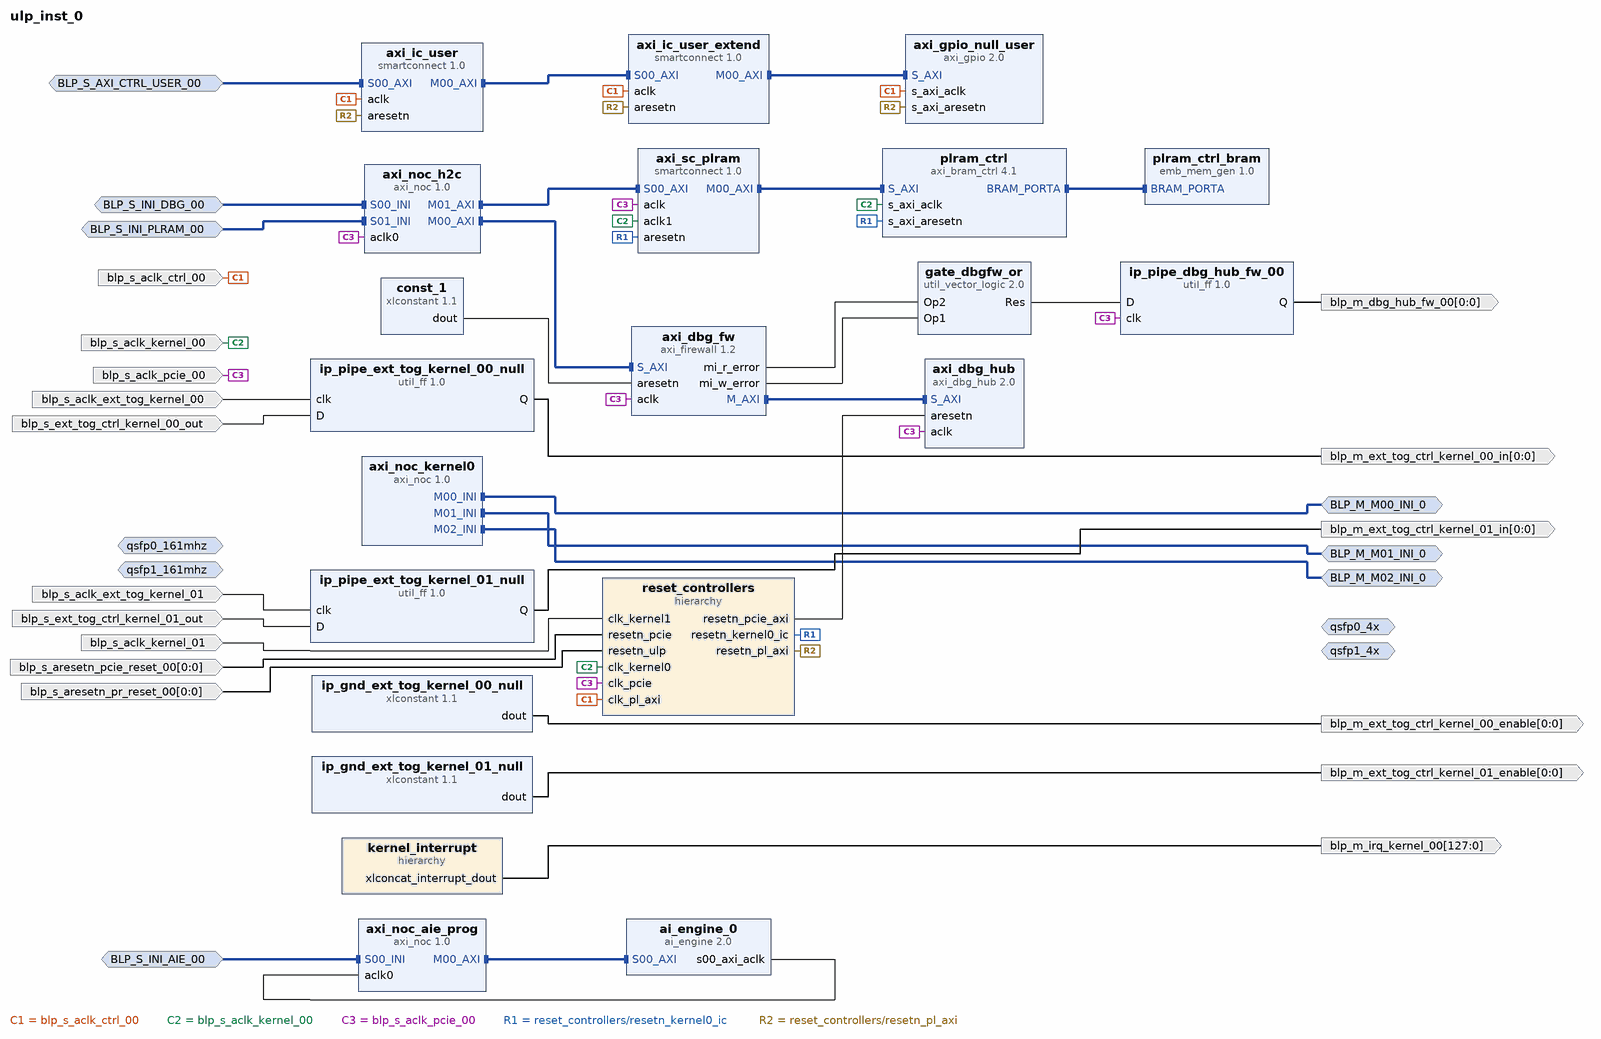
[diagram p0: block diagram of the top level]
# Vivado block design ulp_inst_0, xcvc1902-vsvd1760-2MP-e-S, Vivado 2022.2
create_bd_design ulp_inst_0

create_bd_intf_port -mode Slave -vlnv xilinx.com:interface:aximm_rtl:1.0 BLP_S_AXI_CTRL_USER_00
set_property -dict {CONFIG.master_id 1} [get_bd_intf_ports BLP_S_AXI_CTRL_USER_00]
create_bd_intf_port -mode Slave -vlnv xilinx.com:interface:inimm_rtl:1.0 BLP_S_INI_PLRAM_00
create_bd_intf_port -mode Slave -vlnv xilinx.com:interface:inimm_rtl:1.0 BLP_S_INI_DBG_00
create_bd_intf_port -mode Slave -vlnv xilinx.com:interface:inimm_rtl:1.0 BLP_S_INI_AIE_00
create_bd_intf_port -mode Master -vlnv xilinx.com:interface:inimm_rtl:1.0 BLP_M_M00_INI_0
create_bd_intf_port -mode Master -vlnv xilinx.com:interface:inimm_rtl:1.0 BLP_M_M01_INI_0
create_bd_intf_port -mode Master -vlnv xilinx.com:interface:inimm_rtl:1.0 BLP_M_M02_INI_0
create_bd_intf_port -mode Slave -vlnv xilinx.com:interface:diff_clock_rtl:1.0 qsfp0_161mhz
create_bd_intf_port -mode Master -vlnv xilinx.com:interface:gt_rtl:1.0 qsfp0_4x
create_bd_intf_port -mode Slave -vlnv xilinx.com:interface:diff_clock_rtl:1.0 qsfp1_161mhz
create_bd_intf_port -mode Master -vlnv xilinx.com:interface:gt_rtl:1.0 qsfp1_4x
create_bd_port -dir O -from 127 -to 0 -type intr blp_m_irq_kernel_00
create_bd_port -dir I -type clk blp_s_aclk_ctrl_00
create_bd_port -dir I -type clk blp_s_aclk_kernel_00
create_bd_port -dir I -type clk blp_s_aclk_kernel_01
create_bd_port -dir I -type clk blp_s_aclk_pcie_00
create_bd_port -dir I -from 0 -to 0 -type rst blp_s_aresetn_pcie_reset_00
create_bd_port -dir I -from 0 -to 0 -type rst blp_s_aresetn_pr_reset_00
create_bd_port -dir I -type clk blp_s_aclk_ext_tog_kernel_00
create_bd_port -dir I -type clk blp_s_aclk_ext_tog_kernel_01
create_bd_port -dir I blp_s_ext_tog_ctrl_kernel_00_out
create_bd_port -dir I blp_s_ext_tog_ctrl_kernel_01_out
create_bd_port -dir O -from 0 -to 0 blp_m_ext_tog_ctrl_kernel_00_in
create_bd_port -dir O -from 0 -to 0 blp_m_ext_tog_ctrl_kernel_01_in
create_bd_port -dir O -from 0 -to 0 blp_m_ext_tog_ctrl_kernel_00_enable
create_bd_port -dir O -from 0 -to 0 blp_m_ext_tog_ctrl_kernel_01_enable
create_bd_port -dir O -from 0 -to 0 -type intr blp_m_dbg_hub_fw_00

create_bd_cell -type ip -vlnv xilinx.com:ip:util_ff:1.0 ip_pipe_dbg_hub_fw_00
set_property -dict {CONFIG.C_R_INVERTED 0} [get_bd_cells ip_pipe_dbg_hub_fw_00]
create_bd_cell -type ip -vlnv xilinx.com:ip:util_ff:1.0 ip_pipe_ext_tog_kernel_00_null
set_property -dict {CONFIG.C_R_INVERTED 0} [get_bd_cells ip_pipe_ext_tog_kernel_00_null]
create_bd_cell -type ip -vlnv xilinx.com:ip:util_ff:1.0 ip_pipe_ext_tog_kernel_01_null
set_property -dict {CONFIG.C_R_INVERTED 0} [get_bd_cells ip_pipe_ext_tog_kernel_01_null]
create_bd_cell -type ip -vlnv xilinx.com:ip:xlconstant:1.1 ip_gnd_ext_tog_kernel_00_null
set_property -dict {CONFIG.CONST_VAL 0 CONFIG.CONST_WIDTH 1} [get_bd_cells ip_gnd_ext_tog_kernel_00_null]
create_bd_cell -type ip -vlnv xilinx.com:ip:xlconstant:1.1 ip_gnd_ext_tog_kernel_01_null
set_property -dict {CONFIG.CONST_VAL 0 CONFIG.CONST_WIDTH 1} [get_bd_cells ip_gnd_ext_tog_kernel_01_null]
create_bd_cell -type ip -vlnv xilinx.com:ip:axi_dbg_hub:2.0 axi_dbg_hub
set_property -dict {CONFIG.C_AXI_DATA_WIDTH 128 CONFIG.C_NUM_DEBUG_CORES 0} [get_bd_cells axi_dbg_hub]
create_bd_cell -type ip -vlnv xilinx.com:ip:axi_gpio:2.0 axi_gpio_null_user
set_property -dict {CONFIG.C_GPIO_WIDTH 1} [get_bd_cells axi_gpio_null_user]
create_bd_cell -type ip -vlnv xilinx.com:ip:smartconnect:1.0 axi_ic_user
set_property -dict [list \
  CONFIG.ADVANCED_PROPERTIES {__experimental_features__ {__enable_axi4lite_64_mi__ 1}} \
  CONFIG.NUM_MI 1 \
  CONFIG.NUM_SI 1 \
] [get_bd_cells axi_ic_user]
create_bd_cell -type ip -vlnv xilinx.com:ip:smartconnect:1.0 axi_ic_user_extend
set_property -dict [list \
  CONFIG.ADVANCED_PROPERTIES {__experimental_features__ {__enable_axi4lite_64_mi__ 1}} \
  CONFIG.NUM_MI 1 \
  CONFIG.NUM_SI 1 \
] [get_bd_cells axi_ic_user_extend]
create_bd_cell -type ip -vlnv xilinx.com:ip:axi_noc:1.0 axi_noc_kernel0
set_property -dict [list \
  CONFIG.NUM_CLKS 0 \
  CONFIG.NUM_MI 0 \
  CONFIG.NUM_NMI 3 \
  CONFIG.NUM_NSI 0 \
  CONFIG.NUM_SI 0 \
] [get_bd_cells axi_noc_kernel0]
create_bd_cell -type ip -vlnv xilinx.com:ip:axi_noc:1.0 axi_noc_h2c
set_property -dict {CONFIG.NUM_MI 2 CONFIG.NUM_NMI 0 CONFIG.NUM_NSI 2 CONFIG.NUM_SI 0} [get_bd_cells axi_noc_h2c]
create_bd_cell -type ip -vlnv xilinx.com:ip:smartconnect:1.0 axi_sc_plram
set_property -dict {CONFIG.NUM_CLKS 2 CONFIG.NUM_SI 1} [get_bd_cells axi_sc_plram]
create_bd_cell -type hier kernel_interrupt
create_bd_cell -type ip -vlnv xilinx.com:ip:axi_bram_ctrl:4.1 plram_ctrl
set_property -dict {CONFIG.DATA_WIDTH 512 CONFIG.SINGLE_PORT_BRAM 1} [get_bd_cells plram_ctrl]
create_bd_cell -type ip -vlnv xilinx.com:ip:emb_mem_gen:1.0 plram_ctrl_bram
create_bd_cell -type hier reset_controllers
create_bd_cell -type ip -vlnv xilinx.com:ip:axi_noc:1.0 axi_noc_aie_prog
set_property -dict {CONFIG.NUM_CLKS 1 CONFIG.NUM_MI 1 CONFIG.NUM_NSI 1 CONFIG.NUM_SI 0} [get_bd_cells axi_noc_aie_prog]
create_bd_cell -type ip -vlnv xilinx.com:ip:ai_engine:2.0 ai_engine_0
set_property -dict [list \
  CONFIG.AIE_CORE_REF_CTRL_FREQMHZ 1250 \
  CONFIG.NUM_CLKS 0 \
  CONFIG.NUM_MI_AXI 0 \
  CONFIG.NUM_MI_AXIS 0 \
  CONFIG.NUM_SI_AXIS 0 \
] [get_bd_cells ai_engine_0]
create_bd_cell -type ip -vlnv xilinx.com:ip:axi_firewall:1.2 axi_dbg_fw
set_property -dict {CONFIG.MASK_ERR_RESP 1} [get_bd_cells axi_dbg_fw]
create_bd_cell -type ip -vlnv xilinx.com:ip:xlconstant:1.1 const_1
create_bd_cell -type ip -vlnv xilinx.com:ip:util_vector_logic:2.0 gate_dbgfw_or
set_property -dict {CONFIG.C_OPERATION or CONFIG.C_SIZE 1} [get_bd_cells gate_dbgfw_or]

# ---- hierarchy /kernel_interrupt ----
current_bd_instance /kernel_interrupt
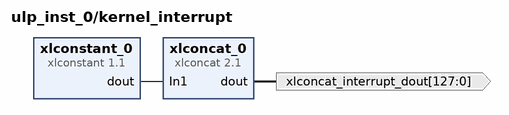
[diagram p1: block diagram inside /kernel_interrupt]
create_bd_pin -dir O -from 127 -to 0 xlconcat_interrupt_dout

create_bd_cell -type ip -vlnv xilinx.com:ip:xlconcat:2.1 xlconcat_0
set_property -dict {CONFIG.IN0_WIDTH 32} [get_bd_cells xlconcat_0]
create_bd_cell -type ip -vlnv xilinx.com:ip:xlconstant:1.1 xlconstant_0
set_property -dict {CONFIG.CONST_VAL 0 CONFIG.CONST_WIDTH 96} [get_bd_cells xlconstant_0]

# ---- hierarchy /reset_controllers ----
current_bd_instance /reset_controllers
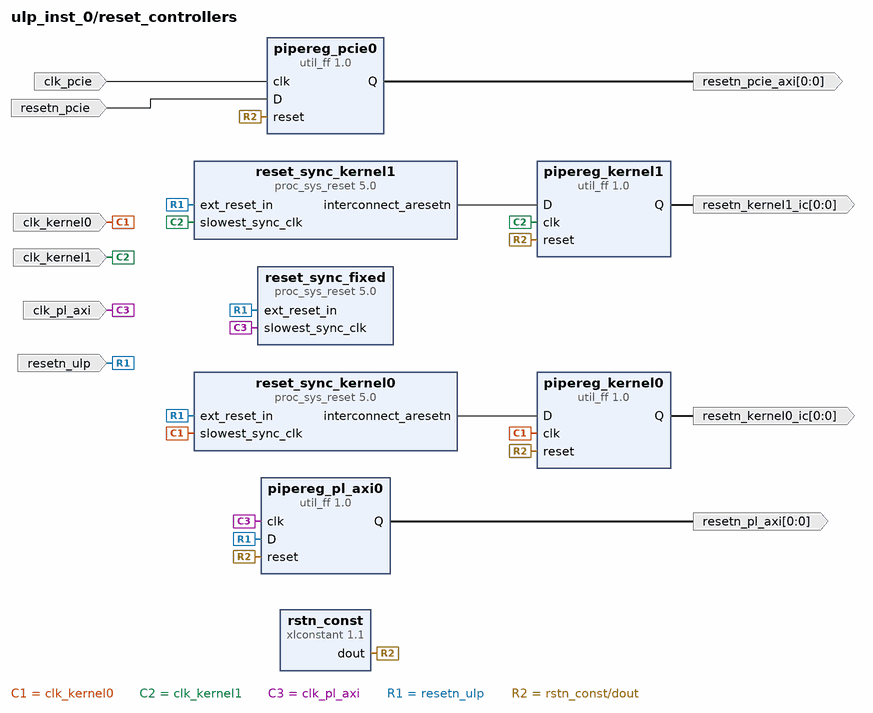
[diagram p2: block diagram inside /reset_controllers]
create_bd_pin -dir I -type clk clk_kernel0
create_bd_pin -dir I -type clk clk_kernel1
create_bd_pin -dir I -type clk clk_pcie
create_bd_pin -dir I -type clk clk_pl_axi
create_bd_pin -dir O -from 0 -to 0 -type rst resetn_kernel0_ic
create_bd_pin -dir O -from 0 -to 0 -type rst resetn_kernel1_ic
create_bd_pin -dir I -type rst resetn_pcie
create_bd_pin -dir O -from 0 -to 0 -type rst resetn_pcie_axi
create_bd_pin -dir O -from 0 -to 0 -type rst resetn_pl_axi
create_bd_pin -dir I -type rst resetn_ulp

create_bd_cell -type ip -vlnv xilinx.com:ip:util_ff:1.0 pipereg_kernel0
create_bd_cell -type ip -vlnv xilinx.com:ip:util_ff:1.0 pipereg_kernel1
create_bd_cell -type ip -vlnv xilinx.com:ip:util_ff:1.0 pipereg_pcie0
create_bd_cell -type ip -vlnv xilinx.com:ip:util_ff:1.0 pipereg_pl_axi0
create_bd_cell -type ip -vlnv xilinx.com:ip:proc_sys_reset:5.0 reset_sync_kernel0
set_property -dict {CONFIG.C_AUX_RESET_HIGH 0 CONFIG.C_AUX_RST_WIDTH 1 CONFIG.C_EXT_RST_WIDTH 1} [get_bd_cells reset_sync_kernel0]
create_bd_cell -type ip -vlnv xilinx.com:ip:proc_sys_reset:5.0 reset_sync_kernel1
set_property -dict {CONFIG.C_AUX_RESET_HIGH 0 CONFIG.C_AUX_RST_WIDTH 1 CONFIG.C_EXT_RST_WIDTH 1} [get_bd_cells reset_sync_kernel1]
create_bd_cell -type ip -vlnv xilinx.com:ip:proc_sys_reset:5.0 reset_sync_fixed
set_property -dict {CONFIG.C_AUX_RESET_HIGH 0 CONFIG.C_AUX_RST_WIDTH 1 CONFIG.C_EXT_RST_WIDTH 1} [get_bd_cells reset_sync_fixed]
create_bd_cell -type ip -vlnv xilinx.com:ip:xlconstant:1.1 rstn_const
set_property -dict {CONFIG.CONST_VAL 1 CONFIG.CONST_WIDTH 1} [get_bd_cells rstn_const]

# ---- connections ----

current_bd_instance /kernel_interrupt
connect_bd_net [get_bd_pins xlconcat_0/dout] [get_bd_pins xlconcat_interrupt_dout]
connect_bd_net [get_bd_pins xlconstant_0/dout] [get_bd_pins xlconcat_0/In1]
set_property PFM.IRQ {In0 {id 0 range 32}} [get_bd_cells xlconcat_0]

current_bd_instance /reset_controllers
connect_bd_net -net clk_kernel0_1 [get_bd_pins clk_kernel0] [get_bd_pins pipereg_kernel0/clk] [get_bd_pins reset_sync_kernel0/slowest_sync_clk]
connect_bd_net -net clk_kernel1_1 [get_bd_pins clk_kernel1] [get_bd_pins pipereg_kernel1/clk] [get_bd_pins reset_sync_kernel1/slowest_sync_clk]
connect_bd_net [get_bd_pins clk_pcie] [get_bd_pins pipereg_pcie0/clk]
connect_bd_net [get_bd_pins clk_pl_axi] [get_bd_pins pipereg_pl_axi0/clk] [get_bd_pins reset_sync_fixed/slowest_sync_clk]
connect_bd_net [get_bd_pins pipereg_kernel0/Q] [get_bd_pins resetn_kernel0_ic]
connect_bd_net [get_bd_pins pipereg_kernel1/Q] [get_bd_pins resetn_kernel1_ic]
connect_bd_net [get_bd_pins pipereg_pcie0/Q] [get_bd_pins resetn_pcie_axi]
connect_bd_net [get_bd_pins pipereg_pl_axi0/Q] [get_bd_pins resetn_pl_axi]
connect_bd_net [get_bd_pins reset_sync_kernel0/interconnect_aresetn] [get_bd_pins pipereg_kernel0/D]
connect_bd_net [get_bd_pins reset_sync_kernel1/interconnect_aresetn] [get_bd_pins pipereg_kernel1/D]
connect_bd_net [get_bd_pins resetn_pcie] [get_bd_pins pipereg_pcie0/D]
connect_bd_net [get_bd_pins resetn_ulp] \
  [get_bd_pins pipereg_pl_axi0/D] [get_bd_pins reset_sync_kernel0/ext_reset_in] [get_bd_pins reset_sync_kernel1/ext_reset_in] \
  [get_bd_pins reset_sync_fixed/ext_reset_in]
connect_bd_net [get_bd_pins rstn_const/dout] \
  [get_bd_pins pipereg_kernel0/reset] [get_bd_pins pipereg_kernel1/reset] [get_bd_pins pipereg_pcie0/reset] \
  [get_bd_pins pipereg_pl_axi0/reset]

current_bd_instance /
connect_bd_intf_net -intf_net BLP_S_AXI_CTRL_USER_00_1 [get_bd_intf_ports BLP_S_AXI_CTRL_USER_00] [get_bd_intf_pins axi_ic_user/S00_AXI]
connect_bd_intf_net -intf_net BLP_S_INI_AIE_00_1 [get_bd_intf_ports BLP_S_INI_AIE_00] [get_bd_intf_pins axi_noc_aie_prog/S00_INI]
connect_bd_intf_net [get_bd_intf_ports BLP_M_M00_INI_0] [get_bd_intf_pins axi_noc_kernel0/M00_INI]
connect_bd_intf_net [get_bd_intf_ports BLP_M_M01_INI_0] [get_bd_intf_pins axi_noc_kernel0/M01_INI]
connect_bd_intf_net [get_bd_intf_ports BLP_M_M02_INI_0] [get_bd_intf_pins axi_noc_kernel0/M02_INI]
connect_bd_intf_net [get_bd_intf_pins axi_ic_user/M00_AXI] [get_bd_intf_pins axi_ic_user_extend/S00_AXI]
connect_bd_intf_net [get_bd_intf_pins axi_gpio_null_user/S_AXI] [get_bd_intf_pins axi_ic_user_extend/M00_AXI]
connect_bd_intf_net [get_bd_intf_pins axi_noc_aie_prog/M00_AXI] [get_bd_intf_pins ai_engine_0/S00_AXI]
connect_bd_intf_net [get_bd_intf_pins axi_noc_h2c/M00_AXI] [get_bd_intf_pins axi_dbg_fw/S_AXI]
connect_bd_intf_net -intf_net axi_noc_h2c_M00_AXI_fw [get_bd_intf_pins axi_dbg_fw/M_AXI] [get_bd_intf_pins axi_dbg_hub/S_AXI]
connect_bd_intf_net [get_bd_intf_pins axi_noc_h2c/M01_AXI] [get_bd_intf_pins axi_sc_plram/S00_AXI]
connect_bd_intf_net [get_bd_intf_ports BLP_S_INI_DBG_00] [get_bd_intf_pins axi_noc_h2c/S00_INI]
connect_bd_intf_net [get_bd_intf_ports BLP_S_INI_PLRAM_00] [get_bd_intf_pins axi_noc_h2c/S01_INI]
connect_bd_intf_net [get_bd_intf_pins axi_sc_plram/M00_AXI] [get_bd_intf_pins plram_ctrl/S_AXI]
connect_bd_intf_net [get_bd_intf_pins plram_ctrl/BRAM_PORTA] [get_bd_intf_pins plram_ctrl_bram/BRAM_PORTA]
connect_bd_net [get_bd_pins ai_engine_0/s00_axi_aclk] [get_bd_pins axi_noc_aie_prog/aclk0]
connect_bd_net [get_bd_pins axi_dbg_fw/mi_r_error] [get_bd_pins gate_dbgfw_or/Op2]
connect_bd_net [get_bd_pins axi_dbg_fw/mi_w_error] [get_bd_pins gate_dbgfw_or/Op1]
connect_bd_net -net blp_m_ext_tog_ctrl_kernel_00_enable_net [get_bd_pins ip_gnd_ext_tog_kernel_00_null/dout] \
  [get_bd_ports blp_m_ext_tog_ctrl_kernel_00_enable]
connect_bd_net -net blp_m_ext_tog_ctrl_kernel_01_enable_net [get_bd_pins ip_gnd_ext_tog_kernel_01_null/dout] \
  [get_bd_ports blp_m_ext_tog_ctrl_kernel_01_enable]
connect_bd_net -net blp_s_aclk_ctrl_00_1 [get_bd_ports blp_s_aclk_ctrl_00] \
  [get_bd_pins axi_gpio_null_user/s_axi_aclk] [get_bd_pins axi_ic_user/aclk] [get_bd_pins axi_ic_user_extend/aclk] \
  [get_bd_pins reset_controllers/clk_pl_axi]
connect_bd_net -net blp_s_aclk_ext_tog_kernel_00_net [get_bd_ports blp_s_aclk_ext_tog_kernel_00] [get_bd_pins ip_pipe_ext_tog_kernel_00_null/clk]
connect_bd_net -net blp_s_aclk_ext_tog_kernel_01_net [get_bd_ports blp_s_aclk_ext_tog_kernel_01] [get_bd_pins ip_pipe_ext_tog_kernel_01_null/clk]
connect_bd_net -net blp_s_aclk_kernel_00_1 [get_bd_ports blp_s_aclk_kernel_00] \
  [get_bd_pins axi_sc_plram/aclk1] [get_bd_pins plram_ctrl/s_axi_aclk] [get_bd_pins reset_controllers/clk_kernel0]
connect_bd_net -net blp_s_aclk_kernel_01_1 [get_bd_ports blp_s_aclk_kernel_01] [get_bd_pins reset_controllers/clk_kernel1]
connect_bd_net -net blp_s_aclk_pcie_00_1 [get_bd_ports blp_s_aclk_pcie_00] \
  [get_bd_pins axi_dbg_hub/aclk] [get_bd_pins axi_noc_h2c/aclk0] [get_bd_pins axi_sc_plram/aclk] \
  [get_bd_pins reset_controllers/clk_pcie] [get_bd_pins axi_dbg_fw/aclk] [get_bd_pins ip_pipe_dbg_hub_fw_00/clk]
connect_bd_net -net blp_s_aresetn_pcie_reset_00_1 [get_bd_ports blp_s_aresetn_pcie_reset_00] [get_bd_pins reset_controllers/resetn_pcie]
connect_bd_net -net blp_s_aresetn_pr_reset_00_1 [get_bd_ports blp_s_aresetn_pr_reset_00] [get_bd_pins reset_controllers/resetn_ulp]
connect_bd_net -net blp_s_ext_tog_ctrl_kernel_00_out_net [get_bd_ports blp_s_ext_tog_ctrl_kernel_00_out] \
  [get_bd_pins ip_pipe_ext_tog_kernel_00_null/D]
connect_bd_net -net blp_s_ext_tog_ctrl_kernel_01_out_net [get_bd_ports blp_s_ext_tog_ctrl_kernel_01_out] \
  [get_bd_pins ip_pipe_ext_tog_kernel_01_null/D]
connect_bd_net [get_bd_pins const_1/dout] [get_bd_pins axi_dbg_fw/aresetn]
connect_bd_net [get_bd_pins gate_dbgfw_or/Res] [get_bd_pins ip_pipe_dbg_hub_fw_00/D]
connect_bd_net -net ip_pipe_dbg_hub_fw_00 [get_bd_pins ip_pipe_dbg_hub_fw_00/Q] [get_bd_ports blp_m_dbg_hub_fw_00]
connect_bd_net [get_bd_pins ip_pipe_ext_tog_kernel_00_null/Q] [get_bd_ports blp_m_ext_tog_ctrl_kernel_00_in]
connect_bd_net [get_bd_pins ip_pipe_ext_tog_kernel_01_null/Q] [get_bd_ports blp_m_ext_tog_ctrl_kernel_01_in]
connect_bd_net [get_bd_pins kernel_interrupt/xlconcat_interrupt_dout] [get_bd_ports blp_m_irq_kernel_00]
connect_bd_net [get_bd_pins reset_controllers/resetn_kernel0_ic] [get_bd_pins axi_sc_plram/aresetn] [get_bd_pins plram_ctrl/s_axi_aresetn]
connect_bd_net -net resetn_pcie_axi_net [get_bd_pins reset_controllers/resetn_pcie_axi] [get_bd_pins axi_dbg_hub/aresetn]
connect_bd_net -net resetn_pl_axi_net [get_bd_pins reset_controllers/resetn_pl_axi] \
  [get_bd_pins axi_gpio_null_user/s_axi_aresetn] [get_bd_pins axi_ic_user/aresetn] [get_bd_pins axi_ic_user_extend/aresetn]
set_property HDL_ATTRIBUTE.DPA_AXILITE_MASTER primary [get_bd_cells axi_ic_user]
set_property PFM.AXI_PORT {M01_AXI {memport "M_AXI_GP"} M02_AXI {memport "M_AXI_GP"} M03_AXI {memport "M_AXI_GP"} M04_AXI {memport "M_AXI_GP"} M05_AXI {memport "M_AXI_GP"} M06_AXI {memport "M_AXI_GP"} M07_AXI {memport "M_AXI_GP"} M08_AXI {memport "M_AXI_GP"} M09_AXI {memport "M_AXI_GP"} M10_AXI {memport "M_AXI_GP"} M11_AXI {memport "M_AXI_GP"} M12_AXI {memport "M_AXI_GP"} M13_AXI {memport "M_AXI_GP"} M14_AXI {memport "M_AXI_GP"} M15_AXI {memport "M_AXI_GP"}} [get_bd_cells axi_ic_user]
set_property PFM.AXI_PORT {M01_AXI {memport "M_AXI_GP"} M02_AXI {memport "M_AXI_GP"} M03_AXI {memport "M_AXI_GP"} M04_AXI {memport "M_AXI_GP"} M05_AXI {memport "M_AXI_GP"} M06_AXI {memport "M_AXI_GP"} M07_AXI {memport "M_AXI_GP"} M08_AXI {memport "M_AXI_GP"} M09_AXI {memport "M_AXI_GP"} M10_AXI {memport "M_AXI_GP"} M11_AXI {memport "M_AXI_GP"} M12_AXI {memport "M_AXI_GP"} M13_AXI {memport "M_AXI_GP"} M14_AXI {memport "M_AXI_GP"} M15_AXI {memport "M_AXI_GP"}} [get_bd_cells axi_ic_user_extend]
set_property HDL_ATTRIBUTE.DPA_TRACE_SLAVE true [get_bd_cells axi_noc_kernel0]
set_property PFM.AXI_PORT {S00_AXI {memport "S_AXI_NOC" sptag "MC_NOC0"} S01_AXI {memport "S_AXI_NOC" sptag "MC_NOC0"} S02_AXI {memport "S_AXI_NOC" sptag "MC_NOC0"} S03_AXI {memport "S_AXI_NOC" sptag "MC_NOC0"} S04_AXI {memport "S_AXI_NOC" sptag "MC_NOC0"} S05_AXI {memport "S_AXI_NOC" sptag "MC_NOC0"} S06_AXI {memport "S_AXI_NOC" sptag "MC_NOC0"} S07_AXI {memport "S_AXI_NOC" sptag "MC_NOC0"} S08_AXI {memport "S_AXI_NOC" sptag "MC_NOC0"} S09_AXI {memport "S_AXI_NOC" sptag "MC_NOC0"} S10_AXI {memport "S_AXI_NOC" sptag "MC_NOC0"} S11_AXI {memport "S_AXI_NOC" sptag "MC_NOC0"} S12_AXI {memport "S_AXI_NOC" sptag "MC_NOC0"} S13_AXI {memport "S_AXI_NOC" sptag "MC_NOC0"} S14_AXI {memport "S_AXI_NOC" sptag "MC_NOC0"} S15_AXI {memport "S_AXI_NOC" sptag "MC_NOC0"} S16_AXI {memport "S_AXI_NOC" sptag "MC_NOC0"} S17_AXI {memport "S_AXI_NOC" sptag "MC_NOC0"} S18_AXI {memport "S_AXI_NOC" sptag "MC_NOC0"} S19_AXI {memport "S_AXI_NOC" sptag "MC_NOC0"} S20_AXI {memport "S_AXI_NOC" sptag "MC_NOC0"} S21_AXI {memport "S_AXI_NOC" sptag "MC_NOC0"} S22_AXI {memport "S_AXI_NOC" sptag "MC_NOC0"} S23_AXI {memport "S_AXI_NOC" sptag "MC_NOC0"} S24_AXI {memport "S_AXI_NOC" sptag "MC_NOC0"} S25_AXI {memport "S_AXI_NOC" sptag "MC_NOC0"}} [get_bd_cells axi_noc_kernel0]
set_property PFM.AXI_PORT {S01_AXI {memport "S_AXI_HP" sptag "BRAM" memory "plram_ctrl Mem0" auto "false"} S02_AXI {memport "S_AXI_HP" sptag "BRAM" memory "plram_ctrl Mem0" auto "false"} S03_AXI {memport "S_AXI_HP" sptag "BRAM" memory "plram_ctrl Mem0" auto "false"} S04_AXI {memport "S_AXI_HP" sptag "BRAM" memory "plram_ctrl Mem0" auto "false"} S05_AXI {memport "S_AXI_HP" sptag "BRAM" memory "plram_ctrl Mem0" auto "false"} S06_AXI {memport "S_AXI_HP" sptag "BRAM" memory "plram_ctrl Mem0" auto "false"} S07_AXI {memport "S_AXI_HP" sptag "BRAM" memory "plram_ctrl Mem0" auto "false"} S08_AXI {memport "S_AXI_HP" sptag "BRAM" memory "plram_ctrl Mem0" auto "false"} S09_AXI {memport "S_AXI_HP" sptag "BRAM" memory "plram_ctrl Mem0" auto "false"} S10_AXI {memport "S_AXI_HP" sptag "BRAM" memory "plram_ctrl Mem0" auto "false"} S11_AXI {memport "S_AXI_HP" sptag "BRAM" memory "plram_ctrl Mem0" auto "false"} S12_AXI {memport "S_AXI_HP" sptag "BRAM" memory "plram_ctrl Mem0" auto "false"} S13_AXI {memport "S_AXI_HP" sptag "BRAM" memory "plram_ctrl Mem0" auto "false"} S14_AXI {memport "S_AXI_HP" sptag "BRAM" memory "plram_ctrl Mem0" auto "false"} S15_AXI {memport "S_AXI_HP" sptag "BRAM" memory "plram_ctrl Mem0" auto "false"}} [get_bd_cells axi_sc_plram]

# ---- address map ----
assign_bd_address -offset 0x0000020200000000 -range 32M -target_address_space [get_bd_addr_spaces BLP_S_AXI_CTRL_USER_00] [get_bd_addr_segs axi_gpio_null_user/S_AXI/Reg]
assign_bd_address -offset 0x0000020000000000 -range 4G -target_address_space [get_bd_addr_spaces BLP_S_INI_AIE_00] [get_bd_addr_segs ai_engine_0/S00_AXI/AIE_ARRAY_0]
assign_bd_address -offset 0x0000020205800000 -range 2M -target_address_space [get_bd_addr_spaces BLP_S_INI_DBG_00] [get_bd_addr_segs axi_dbg_hub/S_AXI_DBG_HUB/Mem0]
assign_bd_address -offset 0x0000020204000000 -range 128K -target_address_space [get_bd_addr_spaces BLP_S_INI_PLRAM_00] [get_bd_addr_segs plram_ctrl/S_AXI/Mem0]

validate_bd_design
save_bd_design
